# EAGLE design public_ASADASIoTV1 (EAGLE 9.6.2)
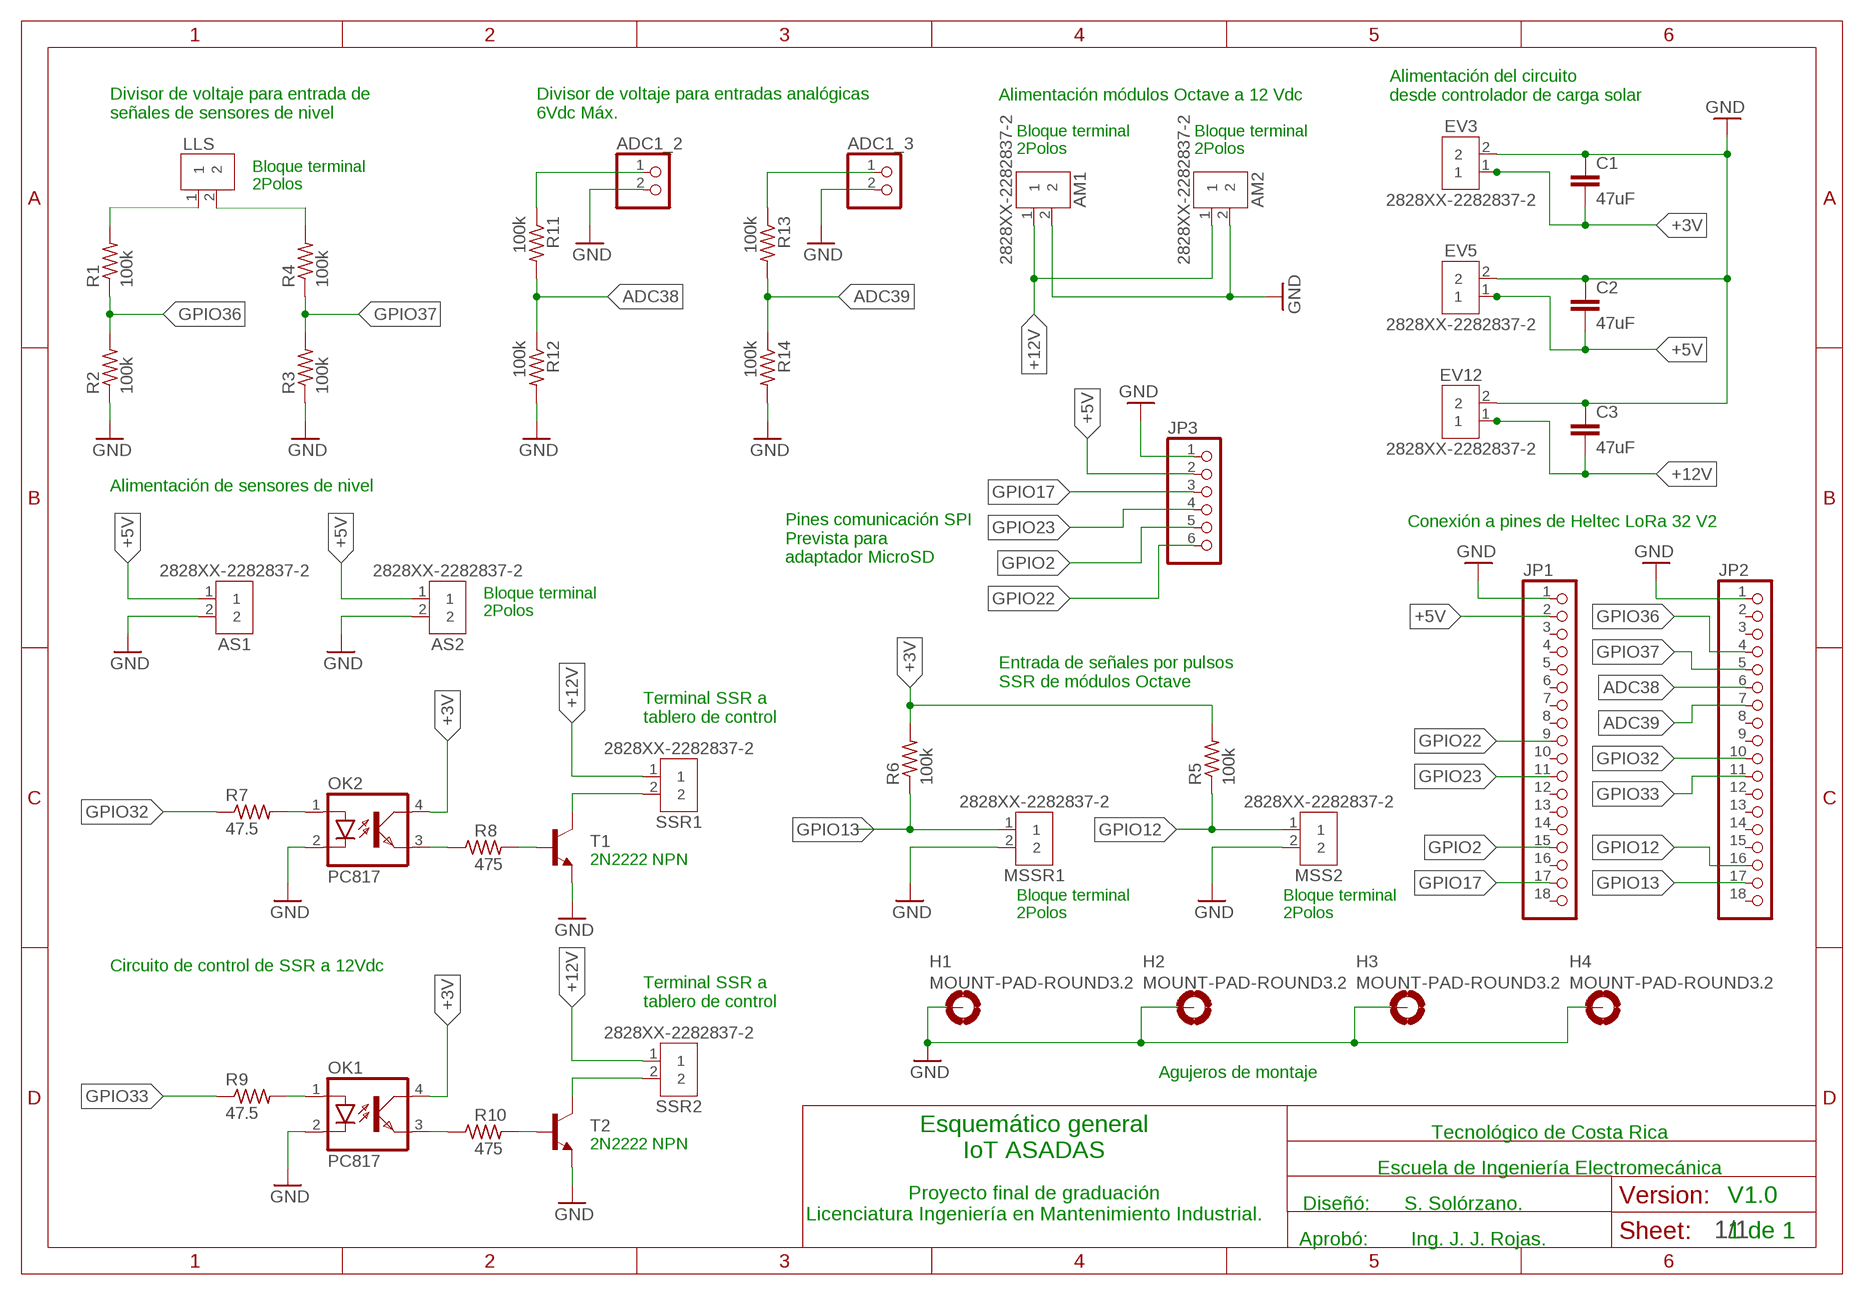
[diagram p0: schematic, sheet 1]
FRAME1 (A4L-JUANJO): SUBTITLE: Block Diagram; TITLE: General

## Parts
ADC1_2  PINHD-1X2  [1X02]
ADC1_3  PINHD-1X2  [1X02]
AM1  2828XX-2282837-2  [TERMBLK_508-2N]
AM2  2828XX-2282837-2  [TERMBLK_508-2N]
AS1  2828XX-2282837-2  [TERMBLK_508-2N]
AS2  2828XX-2282837-2  [TERMBLK_508-2N]
C1  47uF  C2.5/5  [C2.5-5]
C2  47uF  C2.5/5  [C2.5-5]
C3  47uF  C2.5/5  [C2.5-5]
EV3  2828XX-2282837-2  [TERMBLK_508-2N]
EV5  2828XX-2282837-2  [TERMBLK_508-2N]
EV12  2828XX-2282837-2  [TERMBLK_508-2N]
H1  MOUNT-PAD-ROUND3.2  [3,2-PAD]
H2  MOUNT-PAD-ROUND3.2  [3,2-PAD]
H3  MOUNT-PAD-ROUND3.2  [3,2-PAD]
H4  MOUNT-PAD-ROUND3.2  [3,2-PAD]
JP1  PINHD-1X18  [1X18]
JP2  PINHD-1X18  [1X18]
JP3  PINHD-1X6  [1X06]
LLS  2828XX-2282837-2  [TERMBLK_508-2N]
MSS2  2828XX-2282837-2  [TERMBLK_508-2N]
MSSR1  2828XX-2282837-2  [TERMBLK_508-2N]
OK1  PC817  [DIL04]
OK2  PC817  [DIL04]
R1  100k  R-US_R0805  [R0805]
R2  100k  R-US_R0805  [R0805]
R3  100k  R-US_R0805  [R0805]
R4  100k  R-US_R0805  [R0805]
R5  100k  R-US_R0805  [R0805]
R6  100k  R-US_R0805  [R0805]
R7  47.5  R-US_R0805  [R0805]
R8  475  R-US_R0805  [R0805]
R9  47.5  R-US_R0805  [R0805]
R10  475  R-US_R0805  [R0805]
R11  100k  R-US_R0805  [R0805]
R12  100k  R-US_R0805  [R0805]
R13  100k  R-US_R0805  [R0805]
R14  100k  R-US_R0805  [R0805]
SSR1  2828XX-2282837-2  [TERMBLK_508-2N]
SSR2  2828XX-2282837-2  [TERMBLK_508-2N]
T1  2N3904  [TO92]
T2  2N3904  [TO92]

## Nets
+3V: C1.2 EV3.1 OK1.4(COL) OK2.4(COL) R5.2 R6.2
+5V: AS1.1 AS2.1 C2.2 EV5.1 JP1.2 JP3.2
+12V: AM1.1 AM2.1 C3.2 EV12.1 SSR1.1 SSR2.1
ADC38: JP2.6 R11.2 R12.1
ADC39: JP2.7 R13.2 R14.1
GND: ADC1_2.2 ADC1_3.2 AM1.2 AM2.2 AS1.2 AS2.2 C1.1 C2.1 C3.1 EV3.2 EV5.2 EV12.2 H1.B3,2(MOUNT) H2.B3,2(MOUNT) H3.B3,2(MOUNT) H4.B3,2(MOUNT) JP1.1 JP2.1 JP3.1 MSS2.2 MSSR1.2 OK1.2(C) OK2.2(C) R2.1 R3.1 R12.2 R14.2 T1.3(E) T2.3(E)
GPIO2: JP1.15 JP3.5
GPIO12: JP2.16 MSS2.1 R5.1
GPIO13: JP2.17 MSSR1.1 R6.1
GPIO17: JP1.17 JP3.3
GPIO22: JP1.9 JP3.6
GPIO23: JP1.11 JP3.4
GPIO32: JP2.10 R7.1
GPIO33: JP2.11 R9.1
GPIO36: JP2.4 R1.1 R2.2
GPIO37: JP2.5 R3.2 R4.1
HLS: LLS.2 R4.2
LLS: LLS.1 R1.2
N$1: OK2.1(A) R7.2
N$2: SSR1.2 T1.1(C)
N$3: R8.2 T1.2(B)
N$4: OK2.3(EMIT) R8.1
N$5: ADC1_3.1 R13.1
N$6: ADC1_2.1 R11.1
N$7: OK1.1(A) R9.2
N$8: R10.2 T2.2(B)
N$9: OK1.3(EMIT) R10.1
N$10: SSR2.2 T2.1(C)
Unconnected: JP1.3 JP1.4 JP1.5 JP1.6 JP1.7 JP1.8 JP1.10 JP1.12 JP1.13 JP1.14 JP1.16 JP1.18 JP2.2 JP2.3 JP2.8 JP2.9 JP2.12 JP2.13 JP2.14 JP2.15 JP2.18

## Notes on the sheet
- Alimentación módulos Octave a 12 Vdc
- Alimentación del circuito 
  desde controlador de carga solar
- Divisor de voltaje para entrada de 
  señales de sensores de nivel
- Divisor de voltaje para entradas analógicas
  6Vdc Máx.
- Bloque terminal
  2Polos
- Bloque terminal
  2Polos
- Bloque terminal
  2Polos
- Alimentación de sensores de nivel
- Conexión a pines de Heltec LoRa 32 V2
- Pines comunicación SPI 
  Prevista para 
  adaptador MicroSD
- Bloque terminal
  2Polos
- Entrada de señales por pulsos 
  SSR de módulos Octave
- Terminal SSR a 
  tablero de control
- 2N2222 NPN
- Bloque terminal
  2Polos
- Bloque terminal
  2Polos
- Circuito de control de SSR a 12Vdc
- Terminal SSR a 
  tablero de control
- Agujeros de montaje
- Tecnológico de Costa Rica
- 2N2222 NPN
- Esquemático general
  IoT ASADAS
- Escuela de Ingeniería Electromecánica
- Proyecto final de graduación
  Licenciatura Ingeniería en Mantenimiento Industrial.
- Diseñó: | S. Solórzano. | V1.0
- Aprobó: | Ing. J. J. Rojas. | 1 de 1

## Library data of the parts
ADC1_2 ADC1_3 = pinhead:PINHD-1X2: PIN HEADER
AM1 AM2 AS1 AS2 EV3 EV5 EV12 LLS MSS2 MSSR1 SSR1 SSR2 = Connector:2828XX-2: 2 Position Wire to Board Terminal Block Horizontal with Board Datasheet <https://www.te.com.cn/commerce/DocumentDelivery/DDEController?Action=showdoc&DocId=Catalog+Section%7F1308389_EUROSTYLE_TERMINAL_BLOCKS%7F0607%7Fpdf%7FEnglish%7FENG_CS_1308389_EUROSTYLE_TERMINAL_BLOCKS_0607.pdf%7F2-282837-5>; CATEGORY: Connector; DESCRIPTION: 2 Position Wire to Board Terminal Block Horizontal with Board 5.08 mm Through Hole; MANUFACTURER: TE Connectivity; MPN: 282837-2; OPERATING_TEMPERATURE: -40°C to +105°C; PART_STATUS: ACTIVE; ROHS_COMPLIANCE: RoHS Compliant; SERIES: 282837; SUBCATEGORY: Terminal Block; TYPE: Side Wire Entry
C1-C3 = capacitor-wima:C: CAPACITOR naming: grid - package width
H1-H4 = holes:MOUNT-PAD-ROUND: MOUNTING PAD, round
JP1 JP2 = pinhead:PINHD-1X18: PIN HEADER
JP3 = pinhead:PINHD-1X6: PIN HEADER
OK1 OK2 = optocoupler:PC817: SHARP OPTO COUPLER; MPN: PC817X4J000F; OC_FARNELL: 9707727; OC_NEWARK: 97K7059
R1-R14 = rcl:R-US_: RESISTOR, American symbol; SPICEPREFIX: R
T1 T2 = transistor:2N3904: NPN TRANSISTOR

## Board
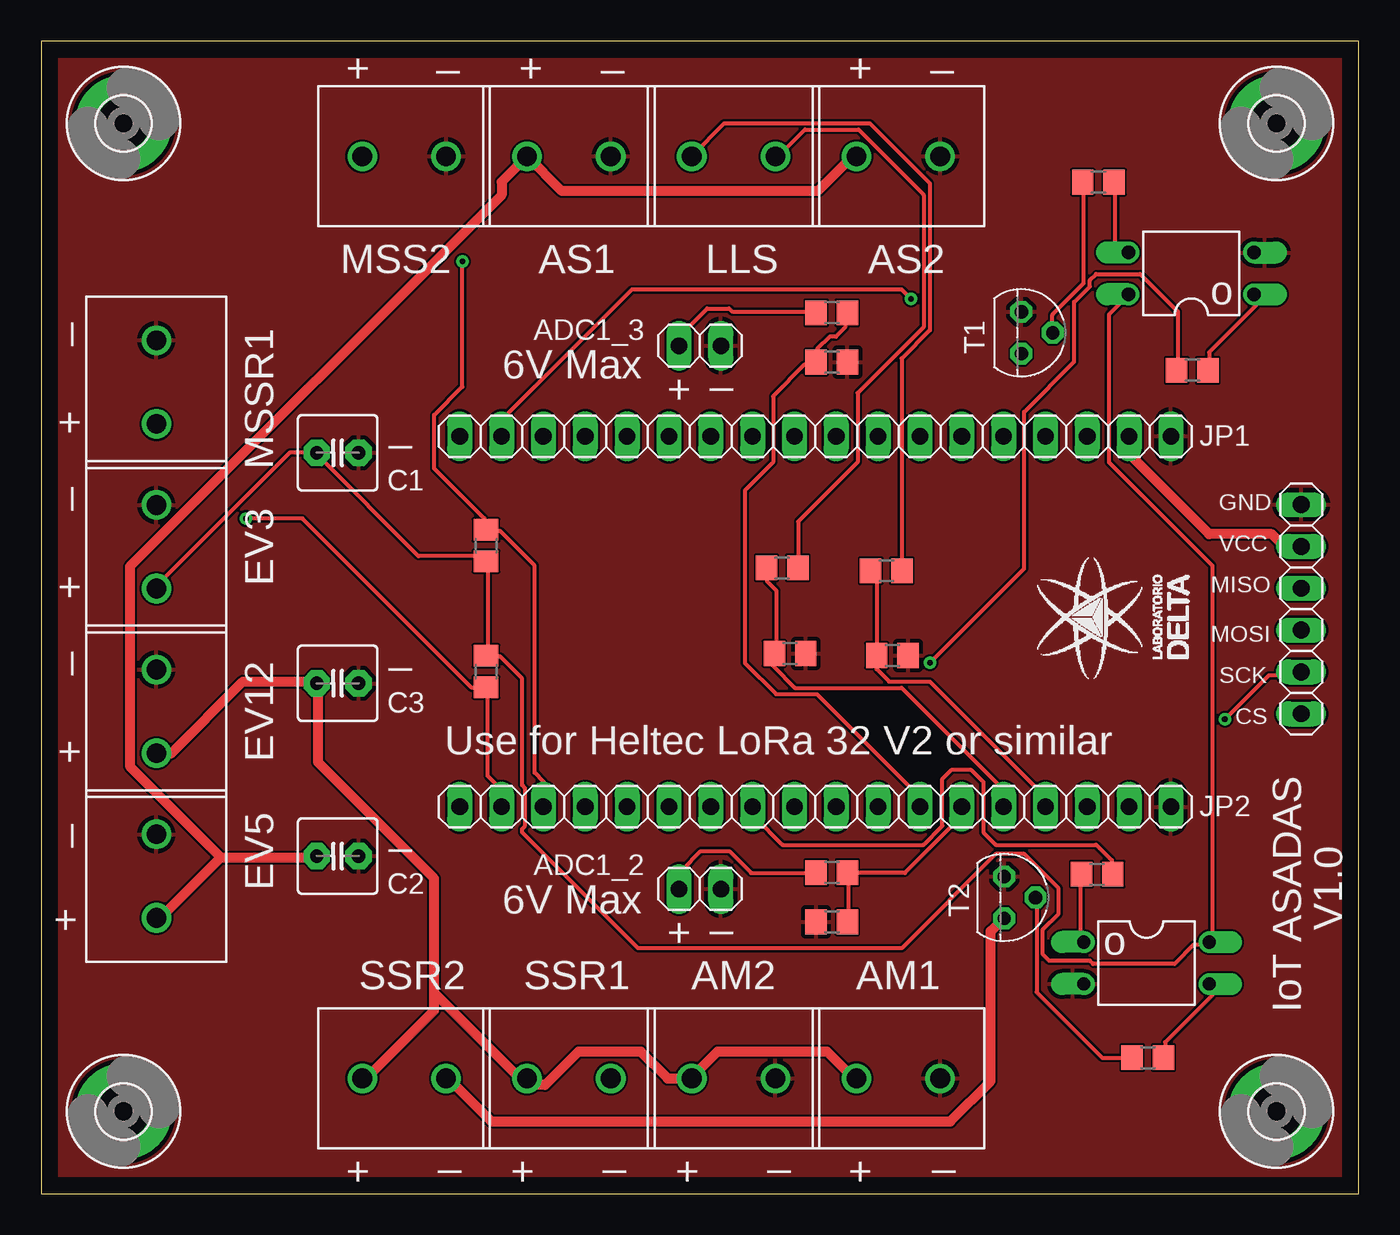
[diagram p1: board, top side]
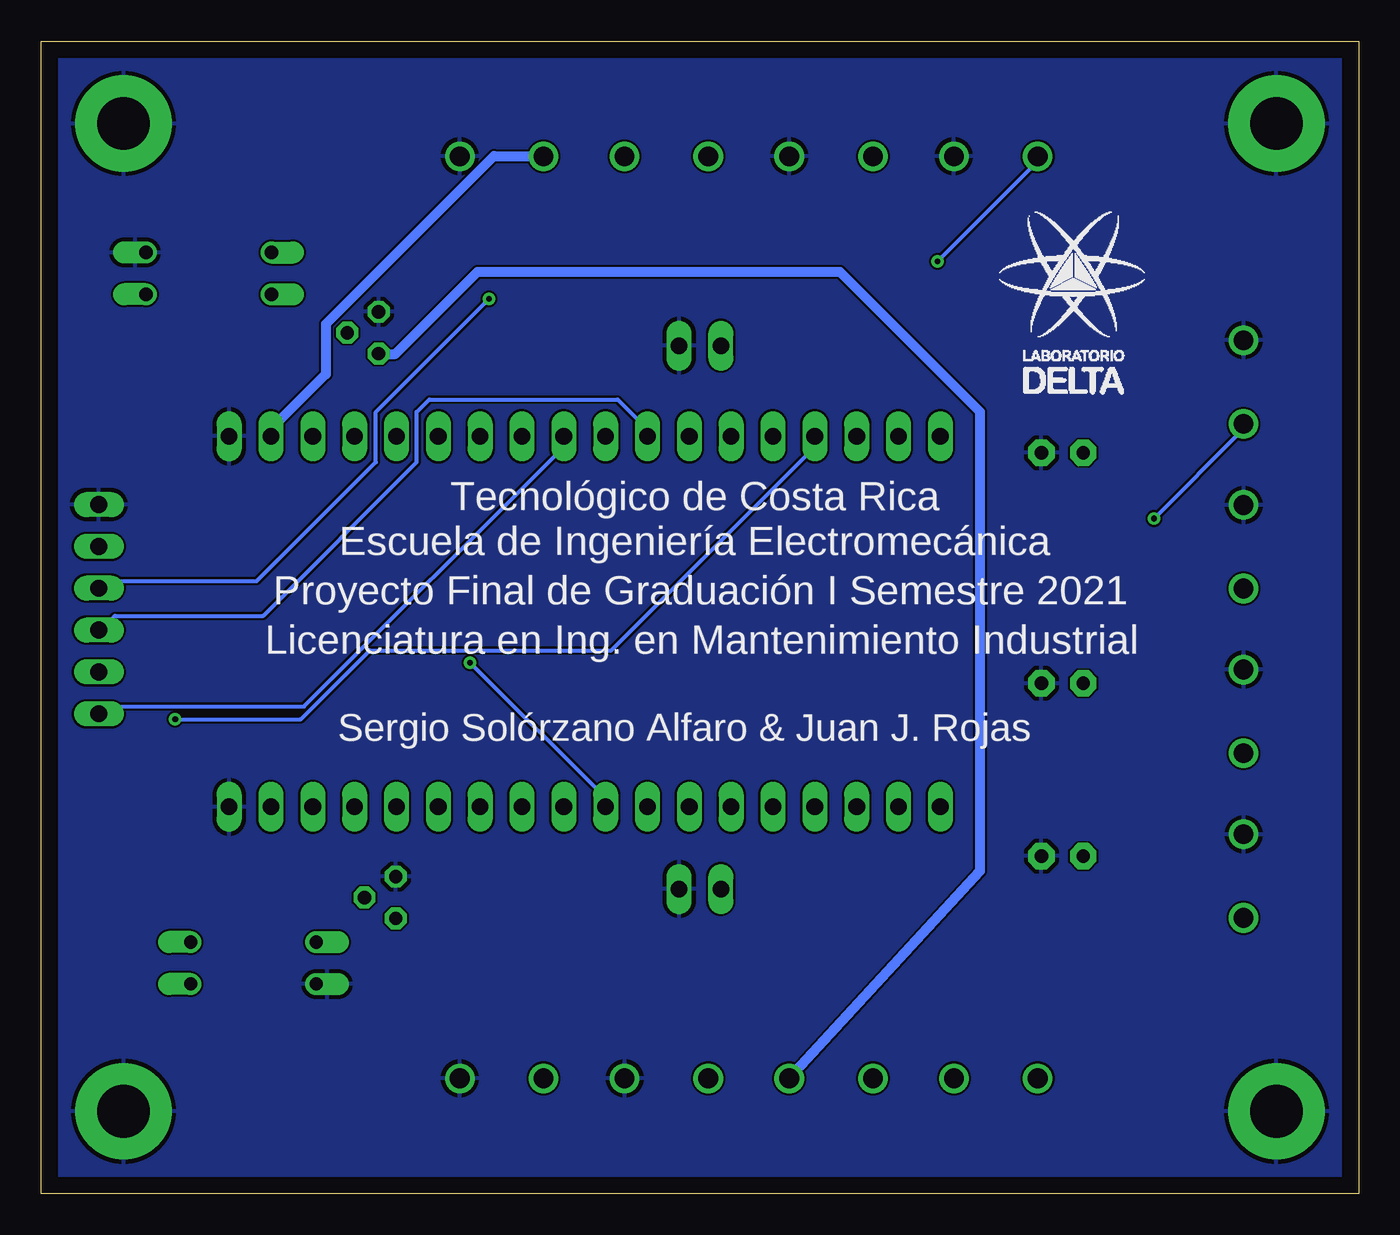
[diagram p2: board, bottom side, seen from below]

Size 80 x 70 mm. Coordinates in mm from the lower left corner, seen from the top.
Outline: 0,0 80,0 80,70 0,70 0,0
Copper layers (1*16): Top 0.035mm / dielectric 1.5mm / Bottom 0.035mm
Design rules "default *": minimum track width 10mil, minimum drill 0.35mm, track to track 5mil, track to pad 0.2mm, pad to pad 0.5mm, via to via 10mil, smd to smd 6mil, copper to edge 40mil, drill to drill 6mil, minimum pad ring 10mil, minimum via ring 8mil, stop-mask expansion 4mil, vias tented up to drill 0mil, thermal gap 10mil

### Footprints (pad centres in the part's own frame; a part is rotated, then mirrored left to right if it is on the bottom)
1X02 = drill 1.016 long: 1 -1.27,0; 2 1.27,0
TERMBLK_508-2N = drill 1.2: 1 0,0; 2 5.08,0
C2.5-5 = drill 0.813 pad 1.6 octagon: 1 -1.27,0; 2 1.27,0
3,2-PAD = drill 3.2 pad 5.842: B3,2 0,0
1X18 = drill 1.016 long: 1 -21.59,0; 2 -19.05,0; 3 -16.51,0; 4 -13.97,0; 5 -11.43,0; 6 -8.89,0; 7 -6.35,0; 8 -3.81,0; 9 -1.27,0; 10 1.27,0; 11 3.81,0; 12 6.35,0; 13 8.89,0; 14 11.43,0; 15 13.97,0; 16 16.51,0; 17 19.05,0; 18 21.59,0
1X06 = drill 1.016 long: 1 -6.35,0; 2 -3.81,0; 3 -1.27,0; 4 1.27,0; 5 3.81,0; 6 6.35,0
DIL04 = drill 0.813 offset: 1 -1.27,-3.81; 2 1.27,-3.81; 3 1.27,3.81; 4 -1.27,3.81
R0805 = smd 1.3 x 1.5: 1 -0.95,0; 2 0.95,0
TO92 = drill 0.813 octagon: 1 1.27,0; 2 0,1.905; 3 -1.27,0

### Placement (x,y rotation side)
ADC1_2  40,18.5 0 top
ADC1_3  40,51.5 0 top
AM1  49.5,7 0 top
AM2  39.5,7 0 top
AS1  29.5,63 0 top
AS2  49.5,63 0 top
C1  18,45 180 top
C2  18,20.5 180 top
C3  18,31 180 top
EV3  7,36.75 90 top
EV5  7,16.75 90 top
EV12  7,26.75 90 top
H1  5,5 0 top
H2  75,5 0 top
H3  75,65 0 top
H4  5,65 0 top
JP1  47,46 180 top
JP2  47,23.5 180 top
JP3  76.5,35.5 270 top
LLS  39.5,63 0 top
MSS2  19.5,63 0 top
MSSR1  7,46.75 90 top
OK1  67.11,14.01 270 top
OK2  69.83,55.89 90 top
R1  51.31,37.83 0 top
R2  51.68,32.69 180 top
R3  45.47,32.81 180 top
R4  44.99,38.01 0 top
R5  27.01,39.36 270 top
R6  27.01,31.71 90 top
R7  69.89,50.01 0 top
R8  64.19,61.44 180 top
R9  64.11,19.4 180 top
R10  67.19,8.26 180 top
R11  48,19.5 0 top
R12  48,16.5 180 top
R13  48,53.5 0 top
R14  48,50.5 0 top
SSR1  29.5,7 0 top
SSR2  19.5,7 0 top
T1  59.51,52.29 270 top
T2  58.47,17.99 270 top

### Tracks (layer width: path | path; a pad name or v marks a point on that pad's centre or on a via)
+3V
  Top 0.254: EV3.1 7.1,36.81 7.48,37.2 7.48,37.39 15.1,45.01 16.62,45.01 C1.2 16.81,44.81 22.91,38.72 26.72,38.72 26.91,38.53 R5.2 27.1,38.34 27.1,32.81 R6.2 27.1,32.62 27.86,32.62 29.19,31.29 29.19,24.81 29.38,24.62 29.38,22.34 29.19,22.14 29.19,21.95 36.24,14.91 52.24,14.91 57.96,20.62 59.67,20.62 61.77,18.53 61.77,17 60.82,16.05 60.82,14.53 61.2,14.14 63.67,14.14 63.87,13.95 68.82,13.95 69.96,15.1 70.91,15.1 OK1.4 71.1,15.29 71.1,38.15 64.82,44.43 64.82,53.39 65.96,54.53 OK2.4
+5V
  Top 0.254: 16.62,20.43 C2.2 | 7.1,16.62 EV5.1
  Top 0.61: JP1.2 66.15,45.96 66.15,44.81 70.91,40.05 74.72,40.05 75.3,39.48 76.44,39.48 JP3.2 | 10.91,20.43 16.62,20.43 | 7.1,16.62 10.91,20.43 | AS2.1 49.26,63 47.15,60.89 31.61,60.89 AS1.1 27.96,61.46 27.96,60.65 5.38,38.08 5.38,25.96 10.91,20.43
  Bottom 0.254: 65.96,46.53 65.96,46.15
  Bottom 0.61: 65.96,46.53 62.72,49.77 62.72,52.82 52.51,63.02 52.5,63 AS2.1 | 65.96,46.15 JP1.2
+12V
  Top 0.254: 7.86,26.72 7.1,26.72 EV12.1 | 16.62,31.1 C3.2 16.81,30.91 | 19.67,7.1 SSR2.1 | 29.34,7.1 29.35,7 SSR1.1
  Top 0.61: 16.62,31.1 12.24,31.1 7.86,26.72 | 19.67,7.1 19.84,7.1 23.86,11.12 23.86,12.12 | 23.86,12.12 23.93,12.12 28.96,7.1 29.34,7.1 | AM1.1 49.34,7 47.72,8.62 41.05,8.62 39.5,7.07 AM2.1 38.03,7 36.41,8.62 32.62,8.62 30.6,6.6 29.9,6.6 SSR1.1 | 16.81,30.91 16.81,26.19 23.86,19.14 23.86,12.12
ADC38
  Top 0.254: 49.01,19.48 49.01,16.62 R12.1 | 49.01,19.48 52.44,19.48 55.86,22.91 55.86,23.48 JP2.6 | 49.01,19.48 R11.2
ADC39
  Top 0.254: R13.2 48.82,53.39 48.82,52.63 48.24,52.05 47.86,52.05 47.1,51.29 47.1,50.53 R14.1 46.91,50.34 46.34,50.34 44.43,48.43 44.43,44.43 42.72,42.72 42.72,32.24 44.62,30.34 47.1,30.34 53.2,24.24 53.2,23.67 JP2.7
GND
  pour Bottom: 0,0 0,70 80,70 80,0
  pour Top: 0,70 0,0 80,0 80,70
  pour Bottom: 0,70 0,0 80,0 80,70
GPIO2  (via drill 0.35)
  Top 0.254: v71.87,28.81 74.53,31.48 76.25,31.48 76.44,31.67 JP3.5
  Bottom 0.254: v71.87,28.81 64.25,28.81 60.05,33 45.39,33 33.19,45.2 33.19,45.96 JP1.15
GPIO12  (via drill 0.35)
  Top 0.254: JP2.16 30.53,23.67 30.53,25 29.96,25.57 29.96,38.15 27.86,40.24 27.1,40.24 R5.1 26.91,40.43 26.91,41.01 23.86,44.05 23.86,47.29 25.57,49.01 v25.57,56.63
  Bottom 0.254: v25.57,56.63 19.67,62.53 19.48,62.53 19.1,62.91 MSS2.1
GPIO13  (via drill 0.35)
  Top 0.254: JP2.17 27.86,23.67 27.86,24.62 27.1,25.38 27.1,30.72 R6.1 26.91,30.72 26.15,30.72 15.86,41.01 v12.43,41.01
  Bottom 0.254: v12.43,41.01 7.1,46.34 7.1,46.72 MSSR1.1
GPIO17  (via drill 0.35)
  Top 0.254: v52.82,54.34 52.24,54.91 35.86,54.91 28.05,47.1 28.05,46.15 JP1.17
  Bottom 0.254: v52.82,54.34 59.67,47.48 59.67,44.43 66.91,37.2 76.06,37.2 76.44,36.81 JP3.3
GPIO22
  Bottom 0.254: JP1.9 48.43,45.96 48.43,45.2 64.06,29.57 76.06,29.57 76.44,29.19 JP3.6
GPIO23
  Bottom 0.254: JP1.11 43.29,46.15 43.29,46.53 45.01,48.24 56.44,48.24 57.2,47.48 57.2,44.43 66.53,35.1 75.53,35.1 76.3,34.34 76.44,34.34 JP3.4
GPIO32  (via drill 0.35)
  Top 0.254: v53.96,32.24 59.67,37.96 59.67,47.48 62.72,50.53 62.72,54.15 63.67,55.1 63.67,55.48 64.06,55.86 66.72,55.86 69.01,53.58 69.01,50.15 R7.1
  Bottom 0.254: v53.96,32.24 45.77,24.05 45.77,23.67 JP2.10
GPIO33
  Top 0.254: R9.1 65.01,19.48 65.01,20.24 64.06,21.19 57.96,21.19 57.2,21.95 57.2,25 56.44,25.77 55.29,25.77 54.72,25.19 54.72,22.34 53.58,21.19 45.01,21.19 43.29,22.91 43.29,23.48 JP2.11
GPIO36
  Top 0.254: R1.1 50.53,37.77 50.72,37.58 50.72,32.81 R2.2 50.72,32.62 50.72,31.86 51.48,31.1 53.96,31.1 60.82,24.24 60.82,23.67 JP2.4
GPIO37
  Top 0.254: R4.1 44.05,37.96 44.05,37.2 44.62,36.62 44.62,32.81 R3.2 44.43,32.62 44.43,32.05 45.77,30.72 52.24,30.72 58.34,24.62 58.34,23.67 JP2.5
HLS
  Top 0.254: R4.2 45.96,38.15 45.96,40.81 49.58,44.43 49.58,48.62 53.58,52.63 53.58,60.67 49.63,64.63 46.36,64.63 44.73,62.99 LLS.2
LLS
  Top 0.254: LLS.1 39.5,63.03 41.48,65.01 50.32,65.01 53.96,61.37 53.96,52.44 52.24,50.72 52.24,37.96 R1.2
N$1
  Top 0.254: R7.2 70.91,50.15 70.91,51.1 73.77,53.96 73.77,54.53 OK2.1
N$2
  Bottom 0.61: T1.1 59.49,51 58.5,51 53.5,56 31.5,56 23,47.5 23,19.58 SSR1.2
N$3
  Top 0.254: R8.2 63.29,61.39 63.29,55.29 61.39,53.39 61.39,52.44 T1.2
N$4
  Top 0.254: R8.1 65.2,61.39 65.2,57.77 65.96,57.01 OK2.3
N$5
  Top 0.254: R13.1 46.91,53.58 41.96,53.58 41.77,53.77 40.43,53.77 38.91,52.24 38.91,51.67 ADC1_3.1
N$6
  Top 0.254: R11.1 46.91,19.48 43.1,19.48 41.77,20.81 40.05,20.81 38.91,19.67 38.91,18.53 ADC1_2.1
N$7
  Top 0.254: R9.2 63.1,19.29 63.1,15.48 OK1.1
N$8
  Top 0.254: R10.2 66.15,8.24 64.44,8.24 60.44,12.24 60.44,17.95 T2.2
N$9
  Top 0.254: R10.1 68.25,8.43 68.25,9.19 71.1,12.05 71.1,12.62 OK1.3
N$10
  Top 0.254: 24.62,7.1 SSR2.2
  Top 0.61: 24.62,7.1 27.34,4.38 55.2,4.38 57.65,6.83 57.65,15.93 58.34,16.62 T2.1

### Text on the board
tPlace: _ | _ | _ | + | + | + | o | _ | _ | 6V Max | + | _ | + | _ | GND | VCC | MISO | + | _ | MOSI | _ | SCK | CS | + | Use for Heltec LoRa 32 V2 or similar | _ | _ | _ | 6V Max | + | V1.0 | + | o | IoT ASADAS | _ | _ | _ | _ | + | + | + | +
bPlace: Tecnológico de Costa Rica | Escuela de Ingeniería Electromecánica | Proyecto Final de Graduación I Semestre 2021 | Licenciatura en Ing. en Mantenimiento Industrial | Sergio Solórzano Alfaro & Juan J. Rojas